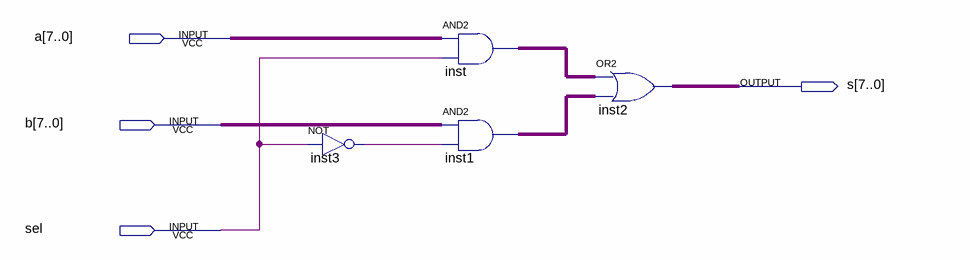
[diagram p0: schematic sheet]
// Quartus schematic mux2x1.bdf as structural Verilog: 4 symbols, 4 pins
module mux2x1 (
  input  [7:0] a,
  input  [7:0] b,
  input  sel,
  output [7:0] s
);

  wire inst3_out;
  wire [7:0] inst1_out, inst_out;

  not inst3 (inst3_out, sel);
  assign inst_out = a & {8{sel}};  // AND2 inst, 8 bits wide
  assign inst1_out = b & {8{inst3_out}};  // AND2 inst1, 8 bits wide
  assign s = inst_out | inst1_out;  // OR2 inst2, 8 bits wide
endmodule
